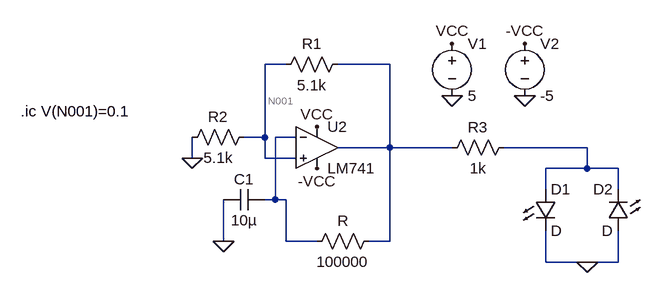
[diagram p0: schematic Lab6_1.asc]
Lab6_1.asc, the LTspice schematic file:
Version 4.1
SHEET 1 880 680
WIRE 160 48 128 48
WIRE 320 48 240 48
WIRE 128 160 128 48
WIRE 128 160 96 160
WIRE 176 160 144 160
WIRE 320 176 320 48
WIRE 320 176 240 176
WIRE 416 176 320 176
WIRE 624 176 496 176
WIRE 16 192 16 160
WIRE 128 192 128 160
WIRE 176 192 128 192
WIRE 624 208 624 176
WIRE 624 208 560 208
WIRE 672 208 624 208
WIRE 560 240 560 208
WIRE 672 240 672 208
WIRE 144 256 144 160
WIRE 144 256 128 256
WIRE 160 256 144 256
WIRE 64 320 64 256
WIRE 160 320 160 256
WIRE 208 320 160 320
WIRE 320 320 320 176
WIRE 320 320 288 320
WIRE 560 352 560 304
WIRE 624 352 560 352
WIRE 672 352 672 304
WIRE 672 352 624 352
FLAG 416 96 0
FLAG 528 96 0
FLAG 416 16 VCC
FLAG 208 208 -VCC
FLAG 528 16 -VCC
FLAG 208 144 VCC
FLAG 64 320 0
FLAG 16 192 0
FLAG 624 352 0
SYMBOL res 256 32 R90
WINDOW 0 0 56 VBottom 2
WINDOW 3 32 56 VTop 2
SYMATTR InstName R1
SYMATTR Value 5.1k
SYMBOL res 112 144 R90
WINDOW 0 0 56 VBottom 2
WINDOW 3 32 56 VTop 2
SYMATTR InstName R2
SYMATTR Value 5.1k
SYMBOL voltage 416 0 R0
WINDOW 123 0 0 Left 0
WINDOW 39 0 0 Left 0
SYMATTR InstName V1
SYMATTR Value 5
SYMBOL voltage 528 0 R0
WINDOW 123 0 0 Left 0
WINDOW 39 0 0 Left 0
SYMATTR InstName V2
SYMATTR Value -5
SYMBOL cap 128 240 R90
WINDOW 0 0 32 VBottom 2
WINDOW 3 32 32 VTop 2
SYMATTR InstName C1
SYMATTR Value 10µ
SYMBOL LED 544 240 R0
SYMATTR InstName D1
SYMBOL LED 688 304 R180
WINDOW 0 24 64 Left 2
WINDOW 3 24 0 Left 2
SYMATTR InstName D2
SYMBOL res 304 304 R90
WINDOW 0 0 56 VBottom 2
WINDOW 3 32 56 VTop 2
SYMATTR InstName R
SYMATTR Value 100000
SYMBOL res 512 160 R90
WINDOW 0 0 56 VBottom 2
WINDOW 3 32 56 VTop 2
SYMATTR InstName R3
SYMATTR Value 1k
SYMBOL LM741 208 112 R0
SYMATTR InstName U2
TEXT -248 120 Left 2 !.ic V(N001)=0.1

The netlist it stands for:
* Lab6_1.asc
R1 N002 N001 5.1k
R2 N001 0 5.1k
V1 VCC 0 5
V2 -VCC 0 -5
C1 N003 0 10µ
D1 N004 0 D
D2 0 N004 D
R N002 N003 100000
R3 N004 N002 1k
X§U2 N001 N003 VCC -VCC N002 LM741  ; pins In+ In- V+ V- OUT
.model D D
.lib standard.dio
.ic V(N001)=0.1
.lib LM741.lib
.backanno
.end